# Altium schematic sheet RPI_Supply.SchDoc: RPI Supply
size A3; SheetNumber: 8; SheetTotal: 9
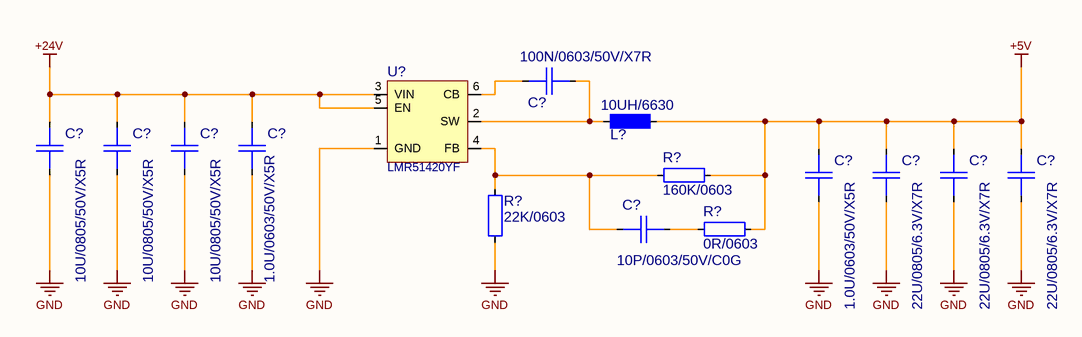
[diagram p0: RPI_Supply.SchDoc]

## Parts
(Parts that share a designator on the sheet are numbered #1, #2 ... from top to bottom, then left to right.)
C?#1  100N/0603/50V/X7R  [CAP0603_X7R]
C?#2  10U/0805/50V/X5R  [CAP0805_X7R]
C?#3  10U/0805/50V/X5R  [CAP0805_X7R]
C?#4  10U/0805/50V/X5R  [CAP0805_X7R]
C?#5  1.0U/0603/50V/X5R  [CAP0603_X7R]
C?#6  1.0U/0603/50V/X5R  [CAP0603_X7R]
C?#7  22U/0805/6.3V/X7R  [CAP0805_X7R]
C?#8  22U/0805/6.3V/X7R  [CAP0805_X7R]
C?#9  22U/0805/6.3V/X7R  [CAP0805_X7R]
C?#10  10P/0603/50V/C0G  [CAP0603_C0G]
L?  10UH/6630  [INDM660730X30]
R?#1  160K/0603  [R0603-0.40-WW]
R?#2  0R/0603  [R0603-0.40-WW]
R?#3  22K/0603  [R0603-0.40-WW]
U?  LMR51420YF  [SOT2395P280X125-6-NW]

## Nets
+5V: C?#6.1 C?#7.1 C?#8.1 C?#9.1 L?.2 R?#1.1 R?#2.2
+24V: C?#2.1 C?#3.1 C?#4.1 C?#5.1 U?.3(VIN) U?.5(EN)
GND: C?#2.2 C?#3.2 C?#4.2 C?#5.2 C?#6.2 C?#7.2 C?#8.2 C?#9.2 R?#3.1 U?.1(GND)
NetC?#1_1: C?#1.1 U?.6(CB)
NetC?#1_2: C?#1.2 L?.1 U?.2(SW)
NetC?#10_1: C?#10.1 R?#1.2 R?#3.2 U?.4(FB)
NetC?#10_2: C?#10.2 R?#2.1

## Notes on the sheet
- Date:
- Size:
- A3
- Schema:
- Layout:

## Library data of the parts
C?#1 = 100N/0603/50V/X7R: CAP SM 0603 100nF 50V X7R; Manufacturer: GENERIC; Manufacturer 1: YAGEO; Manufacturer Part Number 1: CC0603KPX7R9BB104; Absolute Value: 1E-7; Eurocircuits GPN: GPC0603104; Part Number: 100N/0603/50V/X7R; Package: 0603; Value: 100nF; HelpURL: https://www.yageo.com/upload/media/product/app/datasheet/mlcc/upy-gphc_x7r_6_3v-to-250v.pdf; Supplier 1: Digi-Key; Supplier Part Number 1: 311-3567-1-ND; Manufacturer 2: YAGEO; Manufacturer Part Number 2: CC0603MRX7R9BB104; Supplier 2: Digi-Key; Supplier Part Number 2: 311-4110-1-ND; Supplier 3: LCSC; Supplier Part Number 3: C14663; JLC Type: Basic
C?#2-C?#4 = 10U/0805/50V/X5R: CAP SM 0805 10uF 50V X5R; Manufacturer: GENERIC; Manufacturer 1: Murata Electronics; Manufacturer Part Number 1: GRM21BR61H106KE43K; Absolute Value: 1E-5; Eurocircuits GPN: GPN0805106-50-X5R; Part Number: 10U/0805/50V/X5R; Package: 0805; Value: 10uF; HelpURL: https://search.murata.co.jp/Ceramy/image/img/A01X/G101/ENG/GRM21BR61H106KE43-01A.pdf; Supplier 1: Digi-Key; Supplier Part Number 1: 490-GRM21BR61H106KE43KCT-ND; Manufacturer Part Number 3: GRM21BR61H106KE43L; Supplier 3: LCSC; Supplier Part Number 3: C440198; JLC Type: Basic
C?#5 C?#6 = 1.0U/0603/50V/X5R: CAP SM 0603 1.0uF 50V X5R; Manufacturer: GENERIC; Manufacturer 1: Samsung Electro-Mechanics; Manufacturer Part Number 1: CL10A105KB8NNNC; Absolute Value: 1E-6; Eurocircuits GPN: GPC0603105-X5R; Part Number: 1.0U/0603/50V/X5R; Package: 0603; Value: 1.0uF; HelpURL: https://mm.digikey.com/Volume0/opasdata/d220001/medias/docus/658/CL10A105KB8NNNC_Spec.pdf; Supplier 1: Digi-Key; Supplier Part Number 1: 1276-1860-1-ND; Manufacturer Part Number 3: CL10A105KB8NNNC; Supplier 3: LCSC; Supplier Part Number 3: C15849; JLC Type: Basic
C?#7-C?#9 = 22U/0805/6.3V/X7R: CAP SM 0805 22uF 6.3V X7R; Manufacturer: GENERIC; Manufacturer 1: Murata; Manufacturer Part Number 1: GRM21BZ71A226ME15L; Absolute Value: 2.2E-5; Eurocircuits GPN: GPN0805226-6.3; Part Number: 22U/0805/6.3V/X7R; Package: 0805; Value: 22uF; HelpURL: https://search.murata.co.jp/Ceramy/image/img/A01X/G101/ENG/GRM21BZ71A226ME15-01.pdf; Supplier 1: Digi-Key; Supplier Part Number 1: 490-GRM21BZ71A226ME15LCT-ND; Manufacturer 2: Murata; Manufacturer Part Number 2: GRM21BZ70J226ME44L; Supplier 2: Digi-Key; Supplier Part Number 2: 490-GRM21BZ70J226ME44LCT-ND
C?#10 = 10P/0603/50V/C0G: CAP SM 0603 10pF 50V C0G; Manufacturer: GENERIC; Manufacturer 1: YAGEO; Manufacturer Part Number 1: CC0603JRNPO9BN100; Absolute Value: 1E-11; Eurocircuits GPN: GPC0603100-C0G; Part Number: 10P/0603/50V/C0G; Package: 0603; Value: 10pF; HelpURL: https://www.yageo.com/upload/media/product/productsearch/datasheet/mlcc/UPY-GP_NP0_16V-to-50V_18.pdf; Supplier 1: Digi-Key; Supplier Part Number 1: 311-1058-1-ND; Manufacturer 2: YAGEO; Manufacturer Part Number 2: CC0603KRNPO9BN100; Supplier 2: Digi-Key; Supplier Part Number 2: 311-4025-1-ND
L? = 10UH/6630: FIXED IND 10UH 4A 68 MOHM SMD; Manufacturer: GENERIC; Manufacturer 1: Pulse Electronics; Manufacturer Part Number 1: BMRB00060630100MA1; Absolute Value: 1E-5; Part Number: 10UH/6630; Package: 6030 Inductor; Value: 10UH; HelpURL: https://productfinder.pulseelectronics.com/api/open/part-attachments/datasheet/BMRB00060630100MA1; Supplier 1: Digi-Key; Supplier Part Number 1: 553-BMRB00060630100MA1CT-ND; Manufacturer 3: Chilisin Elec; Manufacturer Part Number 3: BMRB00060630100MA1; Supplier 3: LCSC; Supplier Part Number 3: C5201679
R?#1 = 160K/0603: RES SM 0603 160K; Manufacturer: GENERIC; Manufacturer 1: YAGEO; Manufacturer Part Number 1: RC0603FR-13160KL; Absolute Value: 160000; Eurocircuits GPN: GPR0603160K; Part Number: 160K/0603; Package: 0603; Value: 160K; HelpURL: https://www.yageo.com/upload/media/product/productsearch/datasheet/rchip/PYu-RC_Group_51_RoHS_L_12.pdf; Supplier 1: Digi-Key; Supplier Part Number 1: 13-RC0603FR-13160KLCT-ND; Manufacturer 2: YAGEO; Manufacturer Part Number 2: RC0603FR-07160KL; Supplier 2: Digi-Key; Supplier Part Number 2: 311-160KHRCT-ND
R?#2 = 0R/0603: RES SM 0603 0R; Manufacturer: GENERIC; Manufacturer 1: YAGEO; Manufacturer Part Number 1: RC0603FR-070RL; Absolute Value: 0; Eurocircuits GPN: GPR06030R; Part Number: 0R/0603; Package: 0603; Value: 0R; HelpURL: https://www.yageo.com/upload/media/product/app/datasheet/rchip/pyu-rc_group_51_rohs_l.pdf; Supplier 1: Digi-Key; Supplier Part Number 1: 311-0.0HRCT-ND; Manufacturer 2: YAGEO; Manufacturer Part Number 2: RC0603FR-130RL; Supplier 2: Digi-Key; Supplier Part Number 2: 13-RC0603FR-130RLCT-ND; Manufacturer 3: UNI-ROYAL(Uniroyal Elec); Manufacturer Part Number 3: 0603WAF0000T5E; Supplier 3: LCSC; Supplier Part Number 3: C21189; JLC Type: Basic
R?#3 = 22K/0603: RES SM 0603 22K; Manufacturer: GENERIC; Manufacturer 1: YAGEO; Manufacturer Part Number 1: RC0603FR-1322KL; Absolute Value: 22000; Eurocircuits GPN: GPR060322K; Part Number: 22K/0603; Package: 0603; Value: 22K; HelpURL: https://www.yageo.com/upload/media/product/app/datasheet/rchip/pyu-rc_group_51_rohs_l.pdf; Supplier 1: Digi-Key; Supplier Part Number 1: 13-RC0603FR-1322KLCT-ND; Manufacturer 2: YAGEO; Manufacturer Part Number 2: RC0603FR-1022KL; Supplier 2: Digi-Key; Supplier Part Number 2: 13-RC0603FR-1022KLCT-ND; Manufacturer 3: UNI-ROYAL(Uniroyal Elec); Manufacturer Part Number 3: 0603WAF2202T5E; Supplier 3: LCSC; Supplier Part Number 3: C31850; JLC Type: Basic
U? = LMR51420YF: SIMPLE SWITCHER® power converter 4.5-V to 36-V, 2-A, synchronous buck with 40-µA IQ; Manufacturer: Texas Instruments; Manufacturer Part Number 1: LMR51420YFDDCR; Part Number: LMR51420YF; Package: SOIC-8; HelpURL: https://www.ti.com/lit/ds/symlink/lmr51420.pdf; Manufacturer 1: Texas Instruments; Supplier 1: Digi-Key; Supplier Part Number 1: 296-LMR51420YFDDCRCT-ND; Manufacturer 3: Texas Instruments; Manufacturer Part Number 3: LMR51420YFDDCR; Supplier 3: LCSC; Supplier Part Number 3: C7296200